# EAGLE design uCAN Cape (EAGLE 6.4)
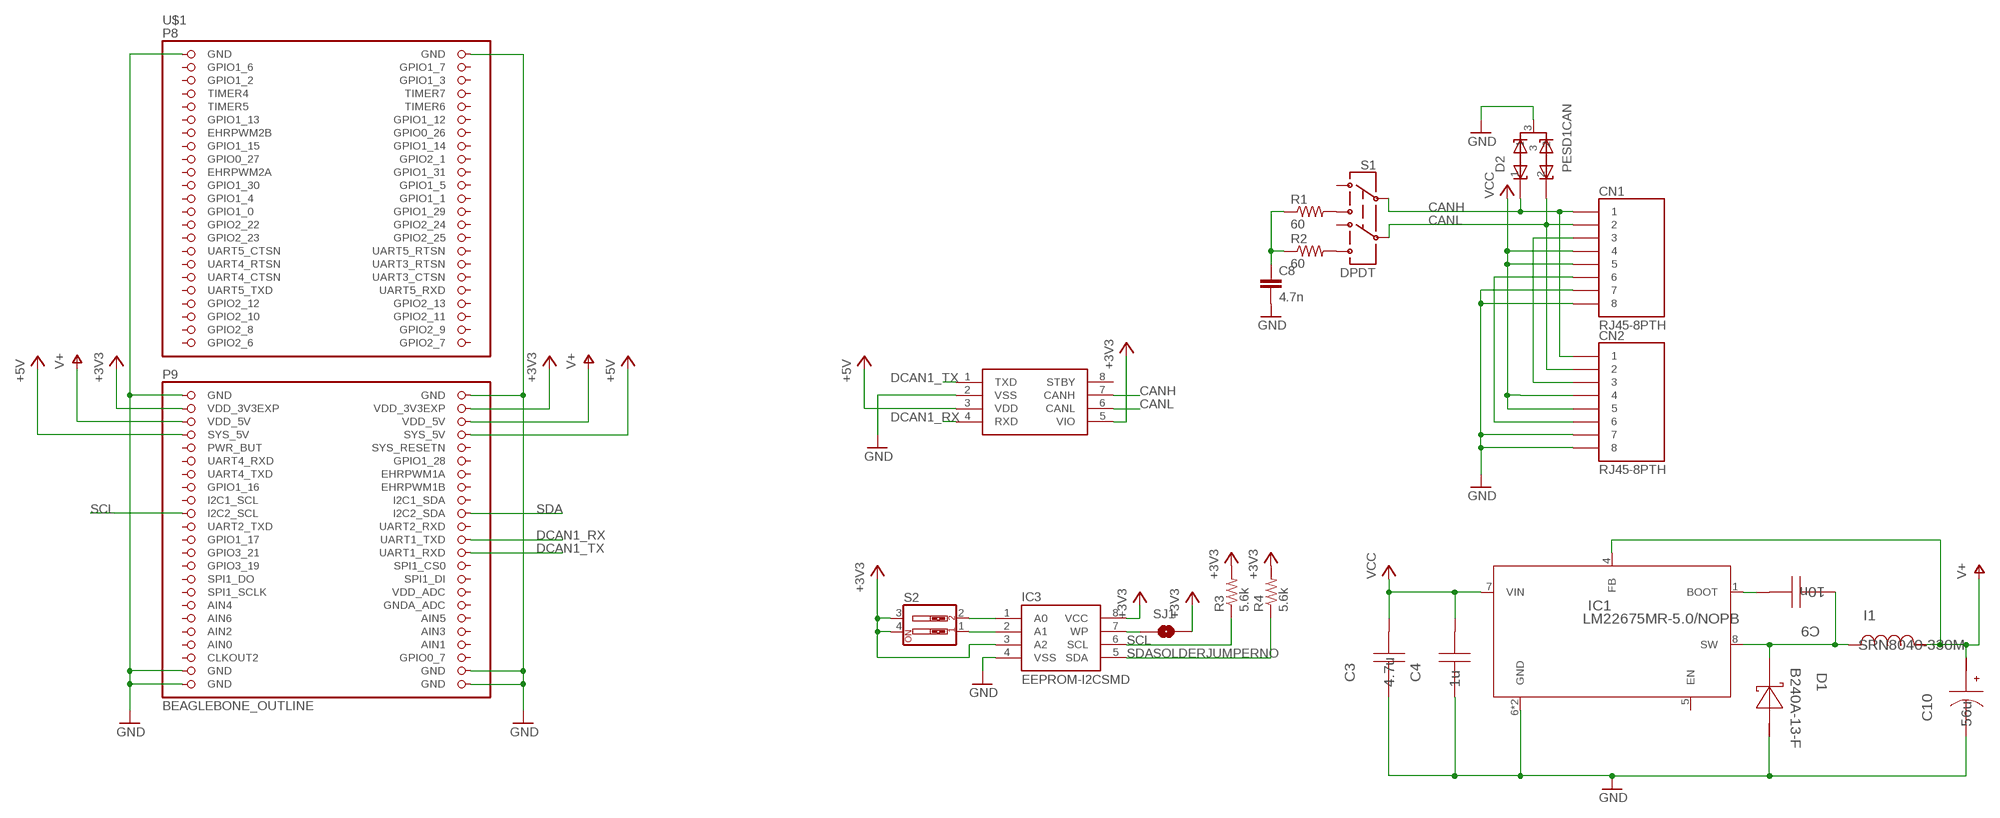
[diagram p0: schematic, sheet 1]

## Parts
C3  4.7u  GRM31CR71H475KA12L  [1206]
C4  1u  GMK212B7105KG-T  [0805]
C8  4.7n  CAP0603-CAP  [0603-CAP]
C9  10n  C0805C103K5RACTU  [0805]
C10  56u  10SVP56M  [SM_RADIAL_6.3AMM]
CN1  RJ45-8PTH  [RJ45-8]
CN2  RJ45-8PTH  [RJ45-8]
D1  B240A-13-F  [SMA]
D2  PESD1CAN  [SOT23]
I1  SRN8040-330M  [SRN8040]
IC1  LM22675MR-5.0/NOPB  [MRA08B]
IC2  MCP2562  [SO08]
IC3  EEPROM-I2CSMD  [SO08]
R1  60  RESISTOR0603-RES  [0603-RES]
R2  60  RESISTOR0603-RES  [0603-RES]
R3  5.6k  RESISTOR0603-RES  [0603-RES]
R4  5.6k  RESISTOR0603-RES  [0603-RES]
S1  DPDT  SWITCH-DPDTAYZ0202  [AYZ0202]
S2  SW_DIP-2  [DIPSWITCH-02]
SJ1  SOLDERJUMPERNO  [SJ_2S-NO]
U$1  BEAGLEBONE_OUTLINE  [BEAGLEBONE_SHIELD]

## Nets
+3V3: IC2.5(VIO) IC3.3(A2) IC3.8(VCC) R3.2 R4.2 S2.3 S2.4 SJ1.2 U$1.49(VDD_3V3EXP) U$1.50(VDD_3V3EXP)
+5V: IC2.3(VDD) U$1.53(SYS_5V) U$1.54(SYS_5V)
A0: IC3.1(A0) S2.2
A1: IC3.2(A1) S2.1
CANH: CN1.1 CN2.1 D2.1 IC2.7(CANH) S1.2
CANL: CN1.2 CN2.2 D2.2 IC2.6(CANL) S1.5
DCAN1_RX: IC2.4(RXD) U$1.70(UART1_TXD)
DCAN1_TX: IC2.1(TXD) U$1.72(UART1_RXD)
GND: C3.2 C4.2 C8.2 C10.2(-) CN1.7 CN1.8 CN2.7 CN2.8 D1.2(A) D2.3 IC1.6(GND) IC1.EPAD(GND) IC2.2(VSS) IC3.4(VSS) U$1.1(GND) U$1.2(GND) U$1.47(GND) U$1.48(GND) U$1.89(GND) U$1.90(GND) U$1.91(GND) U$1.92(GND)
N$1: R1.2 S1.3
N$3: IC3.7(WP) SJ1.1
N$7: R2.2 S1.6
N$8: C8.1 R1.1 R2.1
N$9: CN1.3 CN2.3
N$10: C9.1 IC1.1(BOOT)
N$12: CN1.6 CN2.6
SCL: IC3.6(SCL) R3.1 U$1.65(I2C2_SCL)
SDA: IC3.5(SDA) R4.1 U$1.66(I2C2_SDA)
SWOUT: C9.2 D1.1(K) I1.2 IC1.8(SW)
V+: C10.1(+) I1.1 IC1.4(FB) U$1.51(VDD_5V) U$1.52(VDD_5V)
VCC: C3.1 C4.1 CN1.4 CN1.5 CN2.4 CN2.5 IC1.7(VIN)
Unconnected: IC1.5(EN) IC2.8(STBY) S1.1 S1.4 U$1.3(GPIO1_6) U$1.4(GPIO1_7) U$1.5(GPIO1_2) U$1.6(GPIO1_3) U$1.7(TIMER4) U$1.8(TIMER7) U$1.9(TIMER5) U$1.10(TIMER6) U$1.11(GPIO1_13) U$1.12(GPIO1_12) U$1.13(EHRPWM2B) U$1.14(GPIO0_26) U$1.15(GPIO1_15) U$1.16(GPIO1_14) U$1.17(GPIO0_27) U$1.18(GPIO2_1) U$1.19(EHRPWM2A) U$1.20(GPIO1_31) U$1.21(GPIO1_30) U$1.22(GPIO1_5) U$1.23(GPIO1_4) U$1.24(GPIO1_1) U$1.25(GPIO1_0) U$1.26(GPIO1_29) U$1.27(GPIO2_22) U$1.28(GPIO2_24) U$1.29(GPIO2_23) U$1.30(GPIO2_25) U$1.31(UART5_CTSN) U$1.32(UART5_RTSN) U$1.33(UART4_RTSN) U$1.34(UART3_RTSN) U$1.35(UART4_CTSN) U$1.36(UART3_CTSN) U$1.37(UART5_TXD) U$1.38(UART5_RXD) U$1.39(GPIO2_12) U$1.40(GPIO2_13) U$1.41(GPIO2_10) U$1.42(GPIO2_11) U$1.43(GPIO2_8) U$1.44(GPIO2_9) U$1.45(GPIO2_6) U$1.46(GPIO2_7) U$1.55(PWR_BUT) U$1.56(SYS_RESETN) U$1.57(UART4_RXD) U$1.58(GPIO1_28) U$1.59(UART4_TXD) U$1.60(EHRPWM1A) U$1.61(GPIO1_16) U$1.62(EHRPWM1B) U$1.63(I2C1_SCL) U$1.64(I2C1_SDA) U$1.67(UART2_TXD) U$1.68(UART2_RXD) U$1.69(GPIO1_17) U$1.71(GPIO3_21) U$1.73(GPIO3_19) U$1.74(SPI1_CS0) U$1.75(SPI1_DO) U$1.76(SPI1_DI) U$1.77(SPI1_SCLK) U$1.78(VDD_ADC) U$1.79(AIN4) U$1.80(GNDA_ADC) U$1.81(AIN6) U$1.82(AIN5) U$1.83(AIN2) U$1.84(AIN3) U$1.86(AIN1) U$1.87(CLKOUT2) U$1.88(GPIO0_7)

## Power pins joined to a net without a drawn wire
AIN0: U$1.85(AIN0)

## Library data of the parts
C3 = nickparts:GRM31CR71H475KA12L; CAP: 4.7E-6; ESR: 0.0; IRMS: 0.0; MANUFACTURER_NAME: MuRata; MANUFACTURER_PART_NUMBER: GRM31CR71H475KA12L; VDC: 50.0; VENDOR: MuRata
C4 = nickparts:GMK212B7105KG-T; CAP: 1.0E-6; ESR: 0.0; IRMS: 0.0; MANUFACTURER_NAME: Taiyo Yuden; MANUFACTURER_PART_NUMBER: GMK212B7105KG-T; VDC: 35.0; VENDOR: Taiyo Yuden
C8 = SparkFun-Passives:CAP: Capacitor Standard 0603 ceramic capacitor, and 0.1" leaded capacitor.
C9 = nickparts:C0805C103K5RACTU; CAP: 1.0E-8; ESR: 1.739; IRMS: 0.411; MANUFACTURER_NAME: Kemet; MANUFACTURER_PART_NUMBER: C0805C103K5RACTU; VDC: 50.0; VENDOR: Kemet
C10 = nickparts:10SVP56M; CAP: 5.6E-5; ESR: 0.045; IRMS: 1.7; MANUFACTURER_NAME: Sanyo; MANUFACTURER_PART_NUMBER: 10SVP56M; VDC: 10.0; VENDOR: Sanyo
CN1 CN2 = SparkFun-Connectors:RJ45-8: RJ45 Jack Simple RJ45, 8-pin connection - connector for common Cat5, Cat5e, and Cat6 Ethernet cables. Footprint not yet proven in production. Connector sku is PRT-00643; Breakout PCB sku is BOB-00716.
D1 = nickparts:B240A-13-F; DATASHEETURL: http://www.diodes.com/datasheets/ds13004.pdf; IO: 2.0; MANUFACTURER_NAME: Diodes Inc.; MANUFACTURER_PART_NUMBER: B240A-13-F; VENDOR: Diodes Inc.; VFATIO: 0.5; VRRM: 40.0
D2 = nickparts:PESD1CAN
I1 = nickparts:SRN8040-330M; DATASHEETURL: http://www.bourns.com/data/global/pdfs/SRN8040.pdf; DCR: 0.145; IDC: 1.7; L: 3.3E-5; MANUFACTURER_NAME: Bourns; MANUFACTURER_PART_NUMBER: SRN8040-330M; VENDOR: Bourns
IC1 = nickparts:LM22675MR-5.0/NOPB; DATASHEETURL: http://www.ti.com/product/lm22675; FREQUENCY: 500000.0; IMAX: 1.0; MANUFACTURER_NAME: Texas Instruments; MANUFACTURER_PART_NUMBER: LM22675MR-5.0/NOPB; MKTG_PACKAGE: NA; NSID: LM22675MRE-ADJ/NOPB; PACKAGE: NA; VENDOR: Texas Instruments
IC2 = nickparts:MCP2562: CAN transceiver
IC3 = SparkFun-DigitalIC:EEPROM-I2C: I2C EEPROM chips, 24LC256 (and others)
R1-R4 = SparkFun-Passives:RESISTOR: Resistor Basic schematic elements and footprints for 0603, 1206, and PTH resistors.
S1 = SparkFun-Electromechanical:SWITCH-DPDT: DPDT Version of the COM-00597; PROD_ID: SWCH-08179
S2 = SparkFun-Electromechanical:SW_DIP-2: DIP SWITCH
SJ1 = SparkFun-Passives:SOLDERJUMPER: Solder Jumper Standard SMD solder jumper. Used to automate production. Two varients : Normally Open and Normally Closed are the same, but have different paste layers. NC will have a large amount of paste and should jumper during reflow.
U$1 = adafruit:BEAGLEBONE_OUTLINE: Should match A3 pinout - but not completely tested

## Board
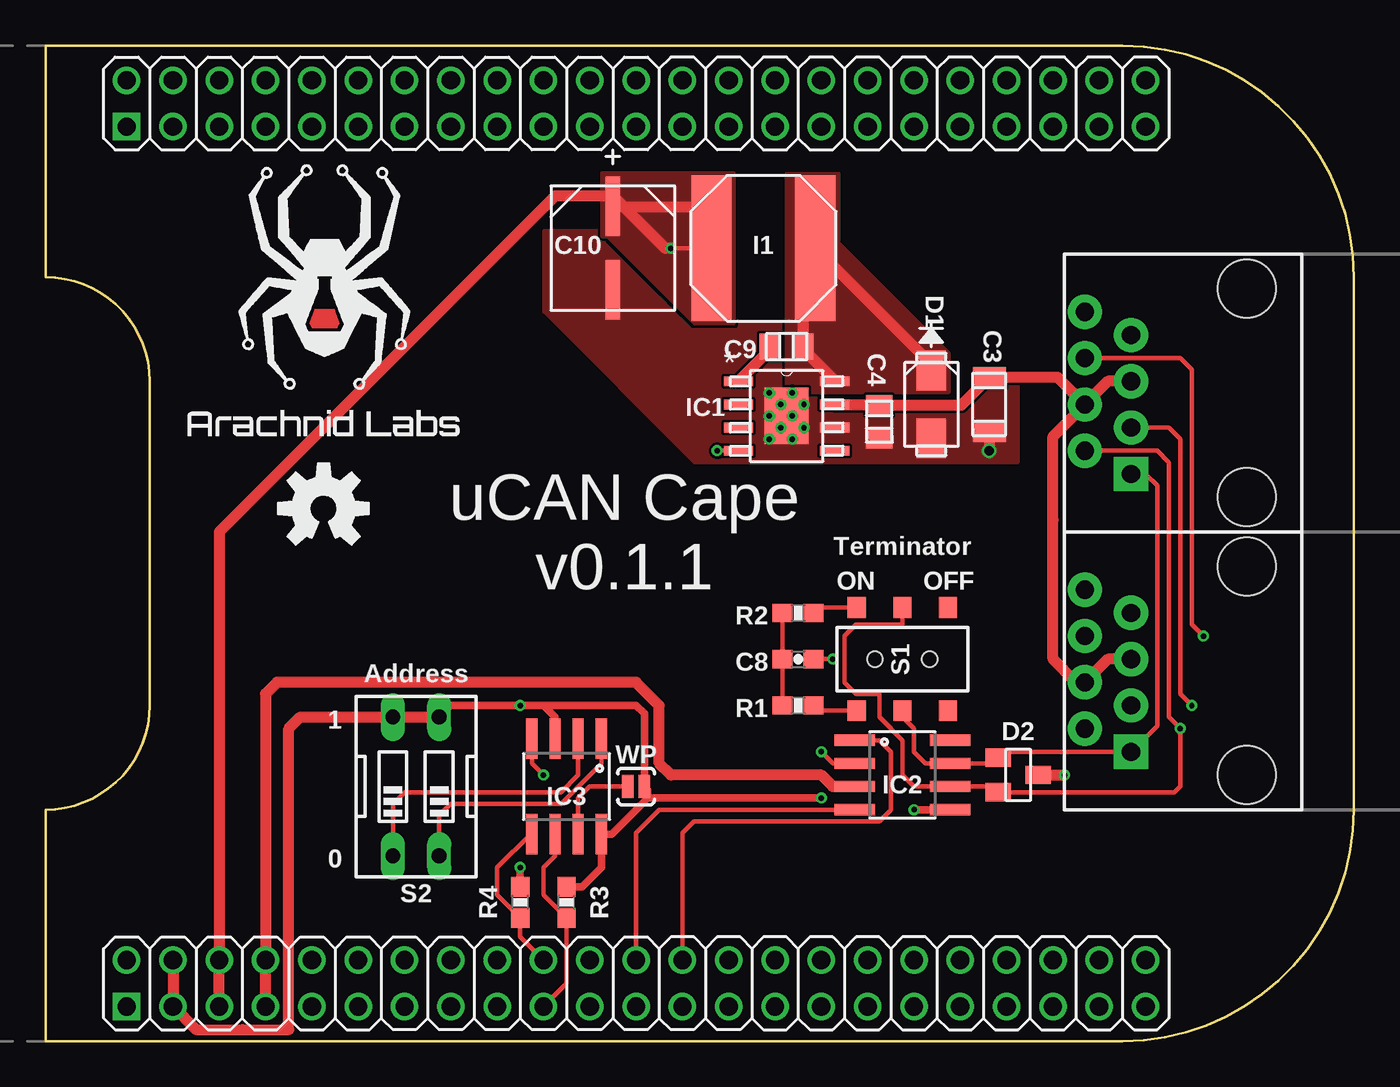
[diagram p1: board, top side]
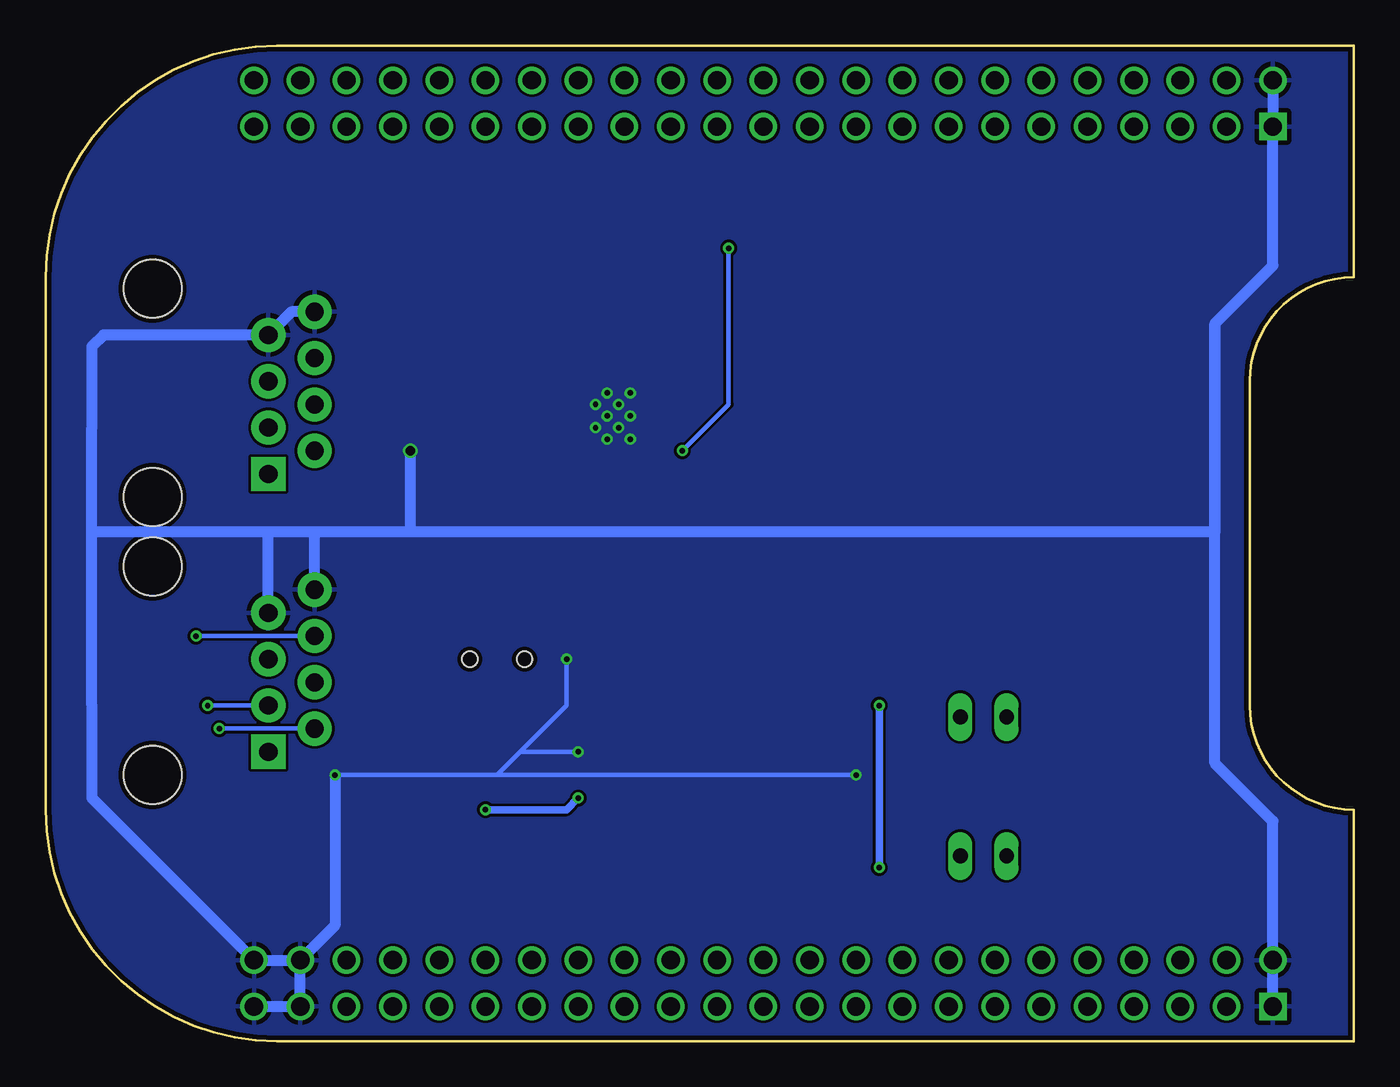
[diagram p2: board, bottom side, seen from below]

Size 71.75 x 54.61 mm. Coordinates in mm from the lower left corner, seen from the top.
Copper layers (1*16): Top 0.035mm / dielectric 1.5mm / Bottom 0.035mm
Design rules "Fusion_eagle_rule_v1.1 *": minimum track width 6mil, minimum drill 0.3mm, track to track 6mil, track to pad 6mil, pad to pad 6mil, via to via 6mil, smd to smd 0mil, copper to edge 10mil, drill to drill 10mil, minimum pad ring 10mil, minimum via ring 6mil, stop-mask expansion 2mil, vias tented up to drill 100mil, thermal gap 10mil

### Footprints (pad centres in the part's own frame; a part is rotated, then mirrored left to right if it is on the bottom)
1206 = smd 1.118 x 1.803: 1 -1.499,0; 2 1.499,0
0805 = smd 1.118 x 1.448: 1 -0.914,0; 2 0.914,0
0603-CAP = smd 1.1 x 1: 1 -0.85,0; 2 0.85,0
SM_RADIAL_6.3AMM = smd 3.251 x 0.787: 1 -2.286,0; 2 2.286,0
RJ45-8 = drill 1 pad 1.88 square: 1 -4.445,6.35 | drill 1 pad 1.88: 2 -3.175,8.89; 3 -1.905,6.35; 4 -0.635,8.89; 5 0.635,6.35; 6 1.905,8.89; 7 3.175,6.35; 8 4.445,8.89 | hole 3.2: -5.715,0; 5.715,0
SMA = smd 2.184 x 1.626: 1 -1.854,0; 2 1.854,0
SOT23 = smd 1 x 1.4: 1 -0.95,-1.1; 2 0.95,-1.1; 3 0,1.1
SRN8040 = smd 2.21 x 8.001: 1 -2.845,0; 2 2.845,0
MRA08B = smd 1.6 x 0.533: 1 -2.642,1.905; 2 -2.642,0.635; 3 -2.642,-0.635; 4 -2.642,-1.905; 5 2.642,-1.905; 6 2.642,-0.635; 7 2.642,0.635; 8 2.642,1.905 | smd 2.413 x 3.099: EPAD 0,0
SO08 = smd 0.61 x 2.21: 1 -1.905,-2.616; 2 -0.635,-2.616; 3 0.635,-2.616; 4 1.905,-2.616; 5 1.905,2.616; 6 0.635,2.616; 7 -0.635,2.616; 8 -1.905,2.616
0603-RES = smd 1.1 x 1: 1 -0.85,0; 2 0.85,0
AYZ0202 = smd 1 x 1.15: 1 -2.5,2.825; 2 0,2.825; 3 2.5,2.825; 4 -2.5,-2.825; 5 0,-2.825; 6 2.5,-2.825 | hole 0.85: 1.5,0; -1.5,0
DIPSWITCH-02 = drill 0.813 long: 1 -1.27,-3.81; 2 1.27,-3.81; 3 1.27,3.81; 4 -1.27,3.81
SJ_2S-NO = smd 0.635 x 1.27: 1 -0.45,0; 2 0.45,0
BEAGLEBONE_SHIELD = drill 1 square: 1 4.445,19.05; 47 52.705,19.05 | drill 1: 2 1.905,19.05; 3 4.445,21.59; 4 1.905,21.59; 5 4.445,24.13; 6 1.905,24.13; 7 4.445,26.67; 8 1.905,26.67; 9 4.445,29.21; 10 1.905,29.21; 11 4.445,31.75; 12 1.905,31.75; 13 4.445,34.29; 14 1.905,34.29; 15 4.445,36.83; 16 1.905,36.83; 17 4.445,39.37; 18 1.905,39.37; 19 4.445,41.91; 20 1.905,41.91; 21 4.445,44.45; 22 1.905,44.45; 23 4.445,46.99; 24 1.905,46.99; 25 4.445,49.53; 26 1.905,49.53; 27 4.445,52.07; 28 1.905,52.07; 29 4.445,54.61; 30 1.905,54.61; 31 4.445,57.15; 32 1.905,57.15; 33 4.445,59.69; 34 1.905,59.69; 35 4.445,62.23; 36 1.905,62.23; 37 4.445,64.77; 38 1.905,64.77; 39 4.445,67.31; 40 1.905,67.31; 41 4.445,69.85; 42 1.905,69.85; 43 4.445,72.39; 44 1.905,72.39; 45 4.445,74.93; 46 1.905,74.93; 48 50.165,19.05; 49 52.705,21.59; 50 50.165,21.59; 51 52.705,24.13; 52 50.165,24.13; 53 52.705,26.67; 54 50.165,26.67; 55 52.705,29.21; 56 50.165,29.21; 57 52.705,31.75; 58 50.165,31.75; 59 52.705,34.29; 60 50.165,34.29; 61 52.705,36.83; 62 50.165,36.83; 63 52.705,39.37; 64 50.165,39.37; 65 52.705,41.91; 66 50.165,41.91; 67 52.705,44.45; 68 50.165,44.45; 69 52.705,46.99; 70 50.165,46.99; 71 52.705,49.53; 72 50.165,49.53; 73 52.705,52.07; 74 50.165,52.07; 75 52.705,54.61; 76 50.165,54.61; 77 52.705,57.15; 78 50.165,57.15; 79 52.705,59.69; 80 50.165,59.69; 81 52.705,62.23; 82 50.165,62.23; 83 52.705,64.77; 84 50.165,64.77; 85 52.705,67.31; 86 50.165,67.31; 87 52.705,69.85; 88 50.165,69.85; 89 52.705,72.39; 90 50.165,72.39; 91 52.705,74.93; 92 50.165,74.93

### Placement (x,y rotation side)
C3  51.75,34.92 270 top
C4  45.72,33.97 270 top
C8  41.27,20.95 0 top
C9  40.64,38.1 0 top
C10  31.12,43.5 270 top
CN1  65.89,20.32 90 top
CN2  65.89,35.56 90 top
D1  48.58,34.92 270 top
D2  53.34,14.61 270 top
I1  39.37,43.5 0 top
IC1  40.64,34.29 0 top
IC2  46.99,14.61 270 top
IC3  28.58,13.97 180 top
R1  41.27,18.41 0 top
R2  41.27,23.5 0 top
R3  28.58,7.62 90 top
R4  26.04,7.62 90 top
S1  46.99,20.95 180 top
S2  20.32,13.97 0 top
SJ1  32.39,13.97 0 top
U$1  -14.61,54.61 270 top
U$2  [ARACHNID_LABS_LOGO]  15.24,43.18 0 top
U$3  [OSHW-LOGO-M]  15.24,29.21 0 top

### Tracks (layer width: path | path; a pad name or v marks a point on that pad's centre or on a via)
+3V3  (via drill 0.3)
  Top 0.406: IC3.3 27.94,17.78 27.3,18.41 | 27.3,18.41 v26.04,18.41 | v26.04,18.41 25.4,18.41 | 25.4,18.41 22.23,18.41 S2.3 | 27.3,18.41 32.39,18.41 32.84,17.96 SJ1.2 33.02,13.79 33.02,13.34 | 32.7,13.02 31.04,11.35 IC3.8 30.48,9.53 29.42,8.47 R3.2 | 32.7,13.02 33.02,13.34 | R4.2 v26.04,9.53 | v26.04,18.41 25.4,18.41 | IC2.5 v47.62,12.7 | v42.55,13.34 33.02,13.34 | 33.02,13.34 32.7,13.02
  Top 0.61: S2.3 S2.4 13.97,17.78 13.34,17.14 13.34,0.64 10.79,0.64 8.26,0.64 U$1.49 U$1.50
  Bottom 0.406: v26.04,9.53 v26.04,18.41 | v47.62,12.7 43.18,12.7 v42.55,13.34
+5V
  Top 0.61: IC2.3 43.18,13.97 42.55,14.61 34.29,14.61 33.66,15.24 33.66,18.41 32.39,19.68 12.7,19.68 12.06,19.05 U$1.54 U$1.53
A0
  Top 0.254: S2.2 21.59,12.38 22.23,13.02 28.26,13.02 30.48,15.24 IC3.1
A1
  Top 0.254: S2.1 19.05,13.02 19.69,13.65 28.26,13.65 29.21,14.61 IC3.2
CANH
  Top 0.254: CN2.1 60.33,31.11 60.96,30.48 60.96,17.3 CN1.1 52.56,15.88 D2.1 51.93,15.24 IC2.7 48.26,15.24 47.62,15.88 47.62,17.14 46.99,17.78 S1.2
CANL  (via drill 0.3)
  Top 0.254: CN2.2 60.96,32.38 61.59,31.75 61.59,17.78 v62.23,17.14 62.23,13.97 61.91,13.65 D2.2 51.93,13.97 IC2.6 47.62,13.97 46.99,14.61 46.99,16.51 45.72,17.78 45.72,19.05 44.45,19.05 43.82,19.68 43.82,21.59 43.82,22.23 44.45,22.86 46.99,22.86 S1.5
  Bottom 0.254: v62.23,17.14 CN1.2
DCAN1_RX
  Top 0.254: IC2.4 33.66,12.7 32.39,11.43 U$1.70
DCAN1_TX
  Top 0.254: IC2.1 45.72,16.51 46.36,15.88 46.36,12.7 45.72,12.06 35.56,12.06 34.93,11.43 U$1.72
GND  (via drill 0.3, 0.5)
  Top 0.254: C8.2 v43.18,20.95 | IC2.2 43.18,15.24 v42.55,15.88 | IC3.4 26.67,15.24 v27.3,14.61
  Top 0.61: D2.3 v55.88,14.61 | C3.2 v51.75,32.38
  Bottom 0.254: v43.18,20.95 43.18,18.41 46.04,15.56 | 46.04,15.56 46.99,14.61 | 46.99,14.61 v55.88,14.61 | v42.55,15.88 45.72,15.88 46.04,15.56 | v27.3,14.61 46.99,14.61
  Bottom 0.61: 69.21,27.94 69.21,18.41 69.21,13.34 U$1.92 U$1.90 | 69.21,27.94 69.21,33.66 69.21,38.1 68.58,38.73 CN2.7 58.27,40.01 CN2.8 | 57.15,27.94 53.34,27.94 51.75,27.94 | 57.15,27.94 59.69,27.94 | 59.69,27.94 61.59,27.94 69.21,27.94 | U$1.91 U$1.89 U$1.90 | v55.88,14.61 55.88,6.35 U$1.90 | U$1.47 U$1.48 4.45,12.06 7.62,15.24 7.62,27.94 | 7.62,27.94 7.62,39.37 | 7.62,39.37 4.45,42.55 4.45,49.53 | 4.45,49.53 U$1.1 | 7.62,39.37 7.62,27.94 | 7.62,27.94 51.75,27.94 | U$1.2 4.45,49.53 | CN1.8 57,27.79 57.15,27.94 | CN1.7 59.54,27.79 59.69,27.94 | v51.75,32.38 51.75,27.94
  other vias: 39.69,35.56 40.96,35.56 41.59,34.92 40.32,34.92 39.69,34.29 40.96,34.29 41.59,33.66 40.96,33.02 40.32,33.66 39.69,33.02
  pour Top (rank 2, no thermals): 30.48,44.45 27.3,44.45 27.3,40.01 35.56,31.75 53.34,31.75 53.34,37.78 49.53,37.78 49.53,35.56 40.64,35.56 40.64,39.37 35.56,39.37
  pour Bottom: -14.61,54.61 71.75,54.61 71.75,0 -14.61,0
N$1
  Top 0.254: S1.3 42.41,18.13 R1.2
N$3
  Top 0.254: SJ1.1 29.84,13.97 29.21,13.34 IC3.7
N$7
  Top 0.254: S1.6 42.41,23.78 R2.2
N$8
  Top 0.254: R2.1 C8.1 R1.1
N$9  (via drill 0.3)
  Top 0.254: CN2.3 61.59,33.66 62.23,33.02 62.23,19.05 v62.87,18.41
  Bottom 0.254: v62.87,18.41 CN1.3
N$10
  Top 0.61: C9.1 39.73,37.92 IC1.1
N$12  (via drill 0.3)
  Top 0.254: v63.5,22.23 62.87,22.86 62.87,36.83 62.23,37.47 CN2.6
  Bottom 0.254: CN1.6 v63.5,22.23
SCL
  Top 0.254: U$1.65 28.58,3.17 R3.1 27.3,8.04 27.3,9.53 27.94,10.16 IC3.6
SDA
  Top 0.254: U$1.66 26.04,5.71 R4.1 24.77,8.04 24.77,9.53 26.59,11.35 IC3.5
SWOUT
  Top 0.61: IC1.8 41.55,37.92 C9.2 41.55,42.84 I1.2 48.58,37.13 D1.1
  pour Top (no thermals): 40.64,35.88 40.64,47.62 43.5,47.62 43.5,43.81 49.53,37.78 49.53,35.56 40.64,35.56
V+  (via drill 0.3)
  Top 0.254: IC1.4 v36.83,32.38 | v34.29,43.5 I1.1
  Top 0.61: U$1.51 U$1.52 9.53,27.94 27.94,46.35 31.12,46.35 33.97,43.5 v34.29,43.5 | C10.1 36.13,45.78 36.2,45.72 36.2,43.83 I1.1
  Bottom 0.254: v36.83,32.38 34.29,34.92 v34.29,43.5
  pour Top (no thermals): 37.78,47.62 30.48,47.62 30.48,44.13 30.8,44.13 35.56,39.37 37.78,39.37
VCC
  Top 0.61: CN2.4 55.25,33.17 55.25,28.57 55.25,20.95 56.52,19.68 CN1.4 58.27,20.95 CN1.5 | CN2.5 58.27,36.2 CN2.4 | IC1.7 45.68,34.92 C4.1 50.22,34.89 C3.1 55.5,36.42 CN2.4

### Text on the board
tNames: Terminator | uCAN Cape / v0.1.1 | ON | OFF | Address | 1 | WP | 0